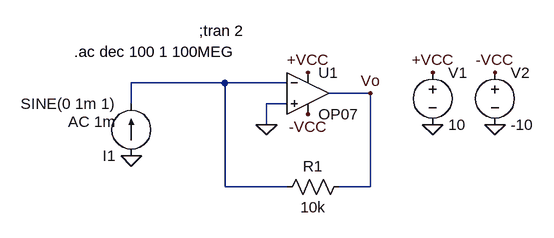
[diagram p0: schematic Draft3.asc]
Draft3.asc, the LTspice schematic file:
Version 4
SHEET 1 880 680
WIRE 112 128 -32 128
WIRE 208 128 112 128
WIRE 336 144 272 144
WIRE -32 160 -32 128
WIRE 208 160 176 160
WIRE 176 192 176 160
WIRE 112 288 112 128
WIRE 208 288 112 288
WIRE 336 288 336 144
WIRE 336 288 288 288
FLAG 432 112 +VCC
FLAG 240 112 +VCC
FLAG 240 176 -VCC
FLAG 528 112 -VCC
FLAG -32 240 0
FLAG 432 192 0
FLAG 528 192 0
FLAG 176 192 0
FLAG 336 144 Vo
SYMBOL Opamps\\OP07 240 80 R0
SYMATTR InstName U1
SYMBOL voltage 432 96 R0
WINDOW 123 0 0 Left 0
WINDOW 39 0 0 Left 0
SYMATTR InstName V1
SYMATTR Value 10
SYMBOL voltage 528 96 R0
SYMATTR InstName V2
SYMATTR Value -10
SYMBOL current -32 240 R180
WINDOW 123 24 52 Left 2
WINDOW 39 0 0 Left 0
SYMATTR InstName I1
SYMATTR Value SINE(0 1m 1)
SYMATTR Value2 AC 1m
SYMBOL res 304 272 R90
WINDOW 0 0 56 VBottom 2
WINDOW 3 32 56 VTop 2
SYMATTR InstName R1
SYMATTR Value 10k
TEXT 72 48 Left 2 !;tran 2
TEXT -120 80 Left 2 !.ac dec 100 1 100MEG

The netlist it stands for:
* Draft3.asc
XU1 0 N001 +VCC -VCC Vo LT1001  ; OP07, pins In+ In- V+ V- OUT
V1 +VCC 0 10
V2 -VCC 0 -10
I1 0 N001 SINE(0 1m 1) AC 1m
R1 Vo N001 10k
;tran 2
.ac dec 100 1 100MEG
.lib LTC.lib
.backanno
.end